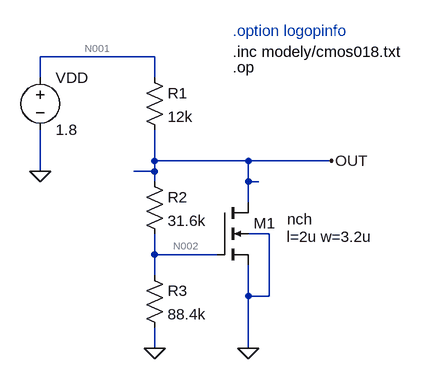
[diagram p0: schematic 2_UREF.asc]
2_UREF.asc, the LTspice schematic file:
Version 4
SHEET 1 1160 952
WIRE -80 112 -256 112
WIRE -256 144 -256 112
WIRE -80 144 -80 112
WIRE -80 272 -80 224
WIRE 64 272 -80 272
WIRE 192 272 64 272
WIRE -256 288 -256 224
WIRE -80 288 -80 272
WIRE -80 288 -112 288
WIRE -80 304 -80 288
WIRE 64 304 64 272
WIRE 80 304 64 304
WIRE 64 336 64 304
WIRE 96 384 64 384
WIRE -80 416 -80 384
WIRE 16 416 -80 416
WIRE -80 448 -80 416
WIRE 64 480 64 432
WIRE 96 480 96 384
WIRE 96 480 64 480
WIRE -80 560 -80 528
WIRE 64 560 64 480
FLAG -256 288 0
FLAG 64 560 0
FLAG -80 560 0
FLAG 192 272 OUT
DATAFLAG 64 272 "round($*100)/100"
DATAFLAG -80 112 "round(I(R1)*10e6)/10e6"
DATAFLAG -112 288 "round(I(R2)*10e6)/10e6"
DATAFLAG 80 304 "round(Id(M1)*10e6)/10e6"
DATAFLAG -32 416 "round($*100)/100"
SYMBOL nmos4 16 336 R0
WINDOW 123 107 53 Left 2
WINDOW 3 108 26 Left 2
SYMATTR Value2 l=2u w=3.2u
SYMATTR Value nch
SYMATTR InstName M1
SYMBOL voltage -256 128 R0
SYMATTR InstName VDD
SYMATTR Value 1.8
SYMBOL res -96 128 R0
SYMATTR InstName R1
SYMATTR Value 12k
SYMBOL res -96 288 R0
SYMATTR InstName R2
SYMATTR Value 31.6k
SYMBOL res -96 432 R0
SYMATTR InstName R3
SYMATTR Value 88.4k
TEXT 40 104 Left 2 !.inc modely/cmos018.txt
TEXT 40 128 Left 2 !.op
TEXT 40 72 Left 2 ;.option logopinfo

The netlist it stands for:
* 2_UREF.asc
M1 OUT N002 0 0 nch l=2u w=3.2u
VDD N001 0 1.8
R1 N001 OUT 12k
R2 OUT N002 31.6k
R3 N002 0 88.4k
.model NMOS NMOS
.model PMOS PMOS
.lib standard.mos
.inc modely/cmos018.txt
.op
* .option logopinfo
.backanno
.end

* Results of the author's LTspice run, read from the files saved beside the schematic
* Operating Point:
*   V(out) = 1.19 V
*   V(n002) = 876.9 mV
*   V(n001) = 1.8 V
*   Id(M1) = 40.88 µA
*   Ig(M1) = 0 A
*   Ib(M1) = -1.2 pA
*   Is(M1) = -40.88 µA
*   I(R1) = 50.8 µA
*   I(R2) = 9.92 µA
*   I(R3) = 9.92 µA
*   I(Vdd) = -50.8 µA
* From the log:
*   Semiconductor Device Operating Points:
*                           --- BSIM3 MOSFETS ---
*   Name:        m1
*   Model:       nch
*   Id:        4.09e-05
*   Vgs:       8.77e-01
*   Vds:       1.19e+00
*   Vbs:       0.00e+00
*   Vth:       3.81e-01
*   Vdsat:     3.63e-01
*   Gm:        1.61e-04
*   Gds:       8.42e-07
*   Gmb        2.14e-04
*   Cbd:       0.00e+00
*   Cbs:       0.00e+00
*   Cgsov:     2.24e-15
*   Cgdov:     2.22e-15
*   Cgbov:     1.98e-18
*   dQgdVgb:   4.80e-14
*   dQgdVdb:  -2.15e-15
*   dQgdVsb:  -7.67e-14
*   dQddVgb:  -1.99e-14
*   dQddVdb:   2.18e-15
*   dQddVsb:   4.23e-14
*   dQbdVgb:  -8.17e-15
*   dQbdVdb:   6.17e-18
*   dQbdVsb:  -1.02e-14